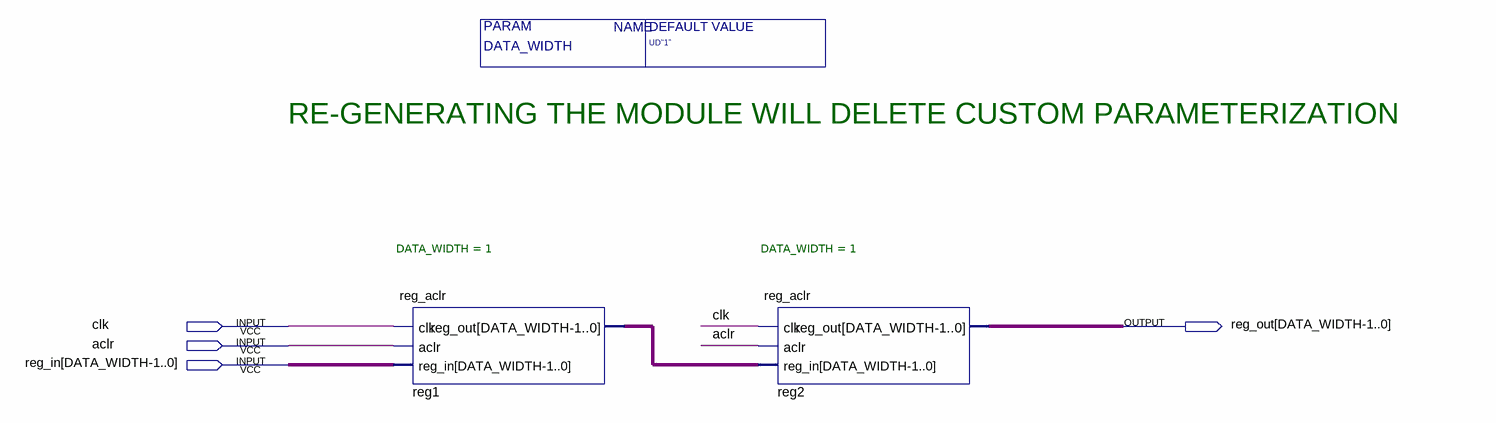
[diagram p0: schematic sheet]
// Quartus schematic reg_delay_2L_aclr.bdf as structural Verilog: 2 symbols, 4 pins
module reg_delay_2L_aclr #(parameter DATA_WIDTH = "UD\"1\"") (
  input  clk,
  input  aclr,
  input  \reg_in[DATA_WIDTH-1..0] ,
  output \reg_out[DATA_WIDTH-1..0] 
);

  wire reg1_reg_out;

  reg_aclr #(.DATA_WIDTH(1)) reg1 (.clk(clk), .aclr(aclr), .reg_in(\reg_in[DATA_WIDTH-1..0] ), .reg_out(reg1_reg_out));
  reg_aclr #(.DATA_WIDTH(1)) reg2 (.clk(clk), .aclr(aclr), .reg_in(reg1_reg_out), .reg_out(\reg_out[DATA_WIDTH-1..0] ));

  // Notes on the sheet:
  //   RE-GENERATING THE MODULE WILL DELETE CUSTOM PARAMETERIZATION
endmodule
